# Altium schematic sheet Callisto Control Board.SchDoc
size A3; SheetNumber: 1; SheetTotal: 12
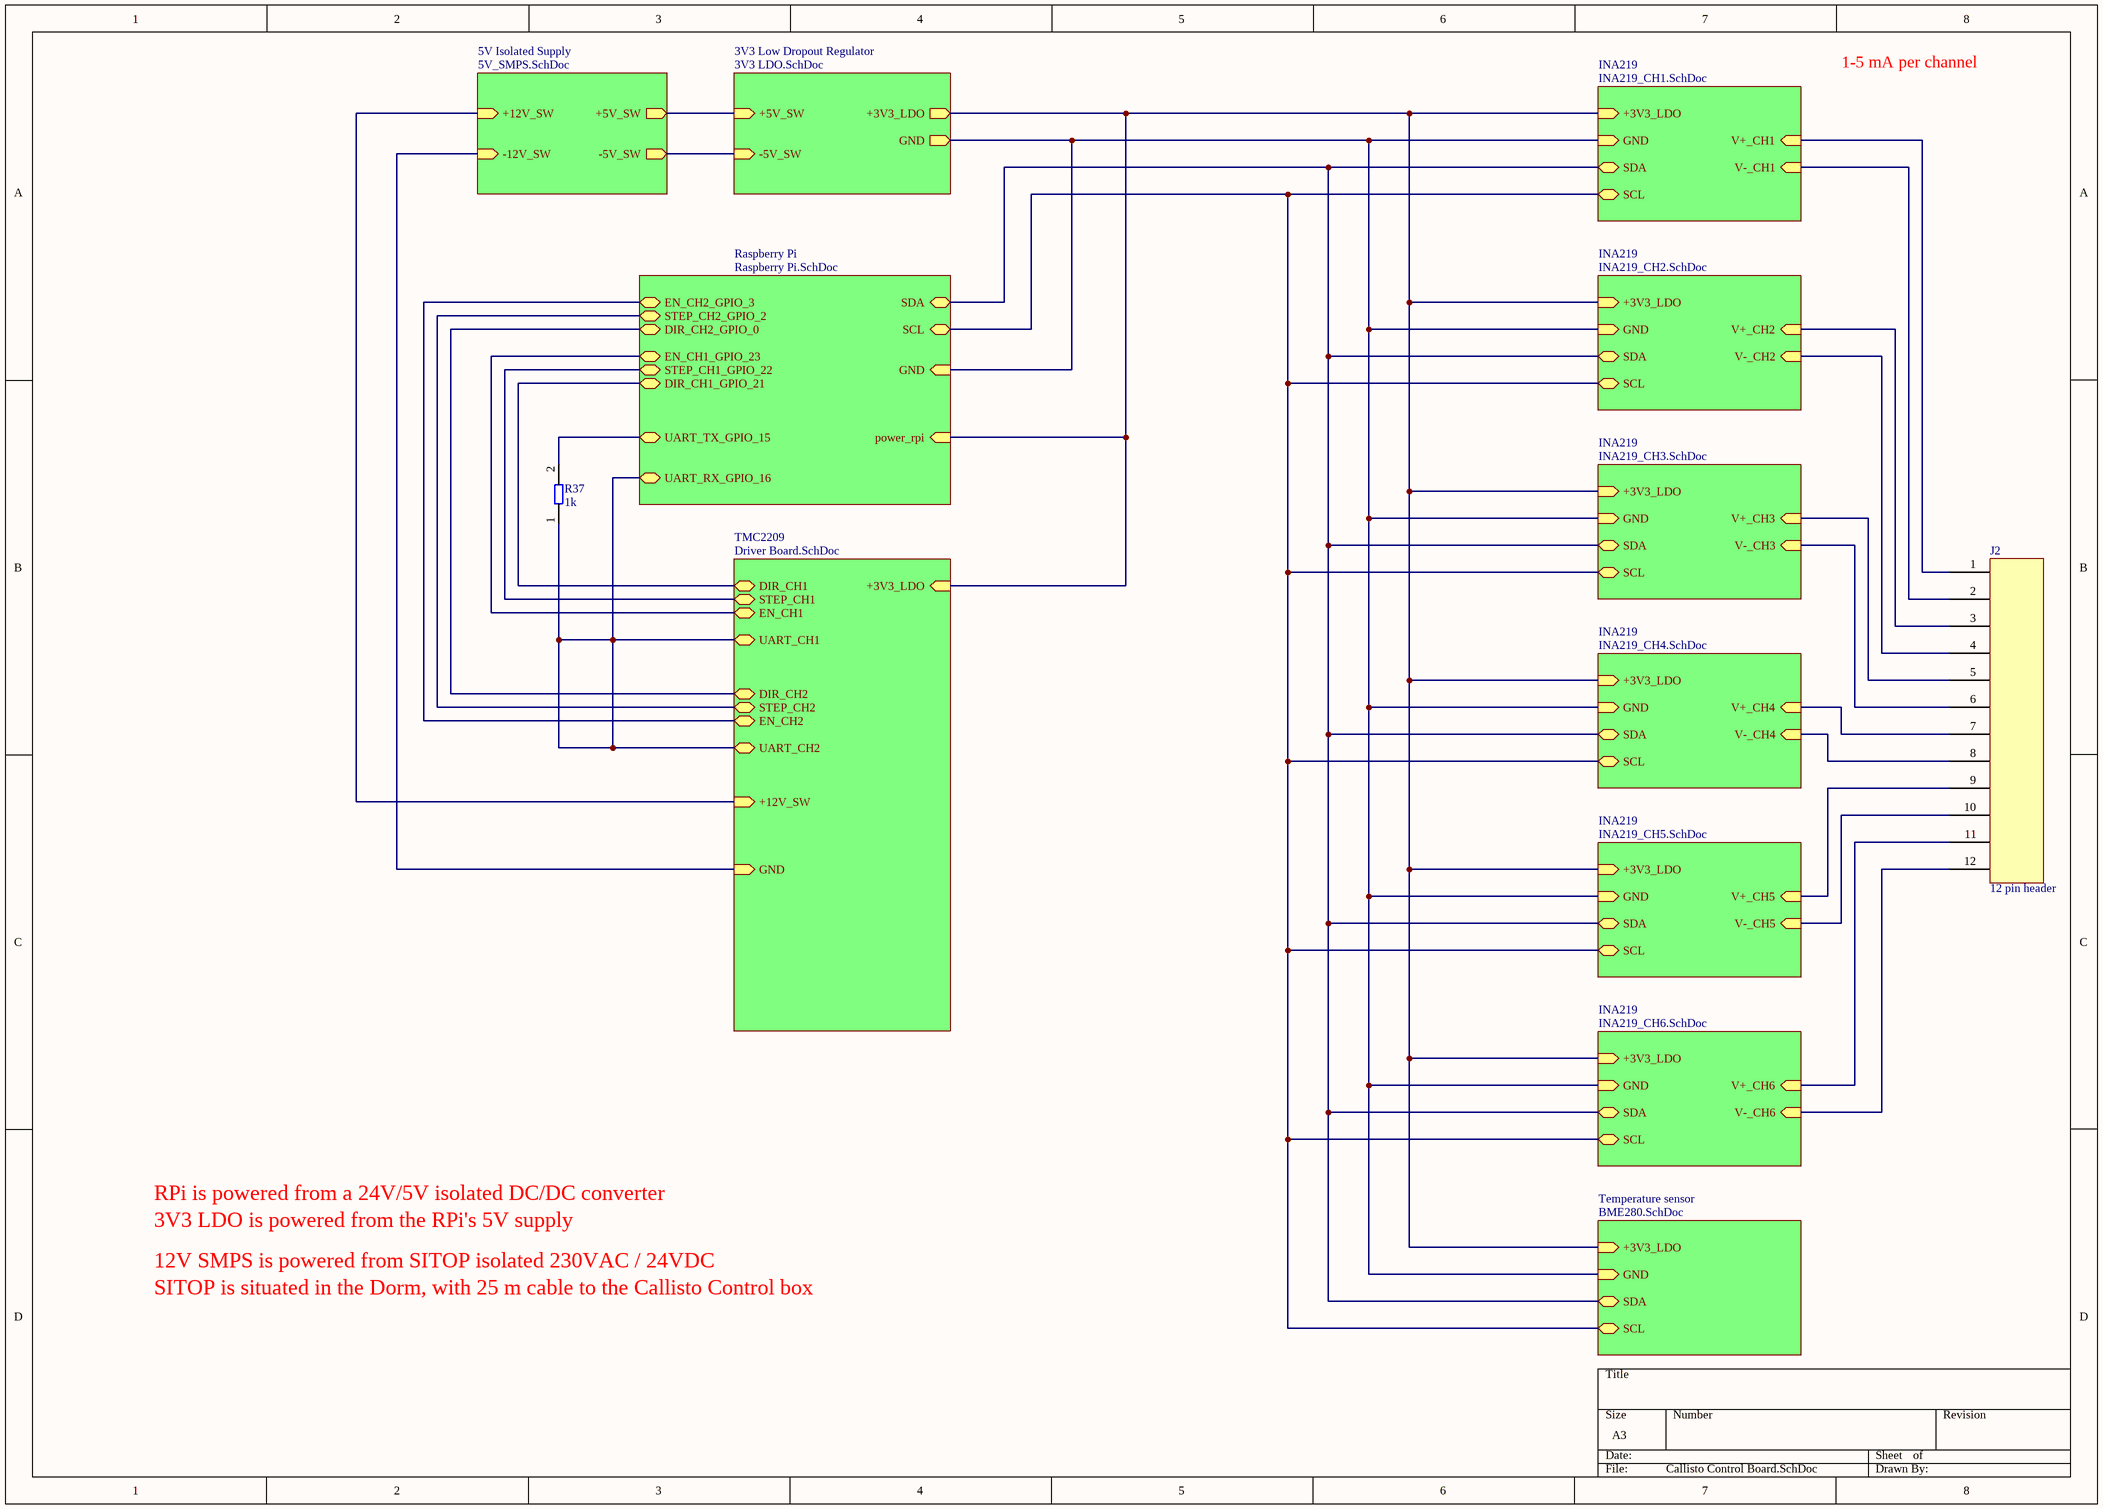
[diagram p0: Callisto Control Board.SchDoc]

## Parts
J2  12 pin header  [12 pin terminal]
R37  1k  [0805 Resistor - IPC A]

## Sub-sheets
3V3 Low Dropout Regulator = 3V3 LDO.SchDoc: +3V3_LDO (out), GND (out), +5V_SW (in), -5V_SW (in)
5V Isolated Supply = 5V_SMPS.SchDoc: +12V_SW (in), -12V_SW (in), +5V_SW (out), -5V_SW (out)
INA219 = INA219_CH1.SchDoc: SDA (bidir), SCL (bidir), +3V3_LDO (in), GND (in), V+_CH1 (in), V-_CH1 (in)
INA219 = INA219_CH2.SchDoc: SDA (bidir), SCL (bidir), +3V3_LDO (in), GND (in), V+_CH2 (in), V-_CH2 (in)
INA219 = INA219_CH3.SchDoc: SDA (bidir), SCL (bidir), +3V3_LDO (in), GND (in), V+_CH3 (in), V-_CH3 (in)
INA219 = INA219_CH4.SchDoc: SDA (bidir), SCL (bidir), +3V3_LDO (in), GND (in), V+_CH4 (in), V-_CH4 (in)
INA219 = INA219_CH5.SchDoc: SDA (bidir), SCL (bidir), +3V3_LDO (in), GND (in), V+_CH5 (in), V-_CH5 (in)
INA219 = INA219_CH6.SchDoc: SDA (bidir), SCL (bidir), +3V3_LDO (in), GND (in), V+_CH6 (in), V-_CH6 (in)
Raspberry Pi = Raspberry Pi.SchDoc: SDA (bidir), SCL (bidir), GND (in), UART_TX_GPIO_15 (bidir), UART_RX_GPIO_16 (bidir), STEP_CH2_GPIO_2 (bidir), EN_CH2_GPIO_3 (bidir), DIR_CH1_GPIO_21 (bidir), STEP_CH1_GPIO_22 (bidir), EN_CH1_GPIO_23 (bidir), DIR_CH2_GPIO_0 (bidir), power_rpi (in)
Temperature sensor = BME280.SchDoc: GND (in), +3V3_LDO (in), SCL (bidir), SDA (bidir)
TMC2209 = Driver Board.SchDoc: +3V3_LDO (in), DIR_CH2 (bidir), STEP_CH2 (bidir), EN_CH2 (bidir), DIR_CH1 (bidir), STEP_CH1 (bidir), EN_CH1 (bidir), +12V_SW (in), GND (in), UART_CH2 (bidir), UART_CH1 (bidir)

## Nets
NetJ2_1: J2.1 ; sheet INA219/V+_CH1
NetJ2_2: J2.2 ; sheet INA219/V-_CH1
NetJ2_3: J2.3 ; sheet INA219/V+_CH2
NetJ2_4: J2.4 ; sheet INA219/V-_CH2
NetJ2_5: J2.5 ; sheet INA219/V+_CH3
NetJ2_6: J2.6 ; sheet INA219/V-_CH3
NetJ2_7: J2.7 ; sheet INA219/V+_CH4
NetJ2_8: J2.8 ; sheet INA219/V-_CH4
NetJ2_9: J2.9 ; sheet INA219/V+_CH5
NetJ2_10: J2.10 ; sheet INA219/V-_CH5
NetJ2_11: J2.11 ; sheet INA219/V+_CH6
NetJ2_12: J2.12 ; sheet INA219/V-_CH6
NetR37_1: R37.1 ; sheet Raspberry Pi/UART_RX_GPIO_16, sheet TMC2209/UART_CH2, sheet TMC2209/UART_CH1
NetR37_2: R37.2 ; sheet Raspberry Pi/UART_TX_GPIO_15
(unnamed): sheet INA219/SDA, sheet INA219/SDA, sheet INA219/SDA, sheet INA219/SDA, sheet INA219/SDA, sheet INA219/SDA, sheet Raspberry Pi/SDA, sheet Temperature sensor/SDA
(unnamed): sheet INA219/SCL, sheet INA219/SCL, sheet INA219/SCL, sheet INA219/SCL, sheet INA219/SCL, sheet INA219/SCL, sheet Raspberry Pi/SCL, sheet Temperature sensor/SCL
(unnamed): sheet INA219/+3V3_LDO, sheet 3V3 Low Dropout Regulator/+3V3_LDO, sheet INA219/+3V3_LDO, sheet INA219/+3V3_LDO, sheet INA219/+3V3_LDO, sheet INA219/+3V3_LDO, sheet INA219/+3V3_LDO, sheet Raspberry Pi/power_rpi, sheet Temperature sensor/+3V3_LDO, sheet TMC2209/+3V3_LDO
(unnamed): sheet INA219/GND, sheet 3V3 Low Dropout Regulator/GND, sheet INA219/GND, sheet INA219/GND, sheet INA219/GND, sheet INA219/GND, sheet INA219/GND, sheet Raspberry Pi/GND, sheet Temperature sensor/GND
(unnamed): sheet 3V3 Low Dropout Regulator/+5V_SW, sheet 5V Isolated Supply/+5V_SW
(unnamed): sheet 3V3 Low Dropout Regulator/-5V_SW, sheet 5V Isolated Supply/-5V_SW
(unnamed): sheet Raspberry Pi/STEP_CH2_GPIO_2, sheet TMC2209/STEP_CH2
(unnamed): sheet Raspberry Pi/EN_CH2_GPIO_3, sheet TMC2209/EN_CH2
(unnamed): sheet Raspberry Pi/DIR_CH1_GPIO_21, sheet TMC2209/DIR_CH1
(unnamed): sheet Raspberry Pi/STEP_CH1_GPIO_22, sheet TMC2209/STEP_CH1
(unnamed): sheet Raspberry Pi/EN_CH1_GPIO_23, sheet TMC2209/EN_CH1
(unnamed): sheet Raspberry Pi/DIR_CH2_GPIO_0, sheet TMC2209/DIR_CH2
(unnamed): sheet TMC2209/+12V_SW, sheet 5V Isolated Supply/+12V_SW
(unnamed): sheet TMC2209/GND, sheet 5V Isolated Supply/-12V_SW

## Notes on the sheet
- 1-5 mA per channel
- RPi is powered from a 24V/5V isolated DC/DC converter
- 3V3 LDO is powered from the RPi's 5V supply
- 12V SMPS is powered from SITOP isolated 230VAC / 24VDC
- SITOP is situated in the Dorm, with 25 m cable to the Callisto Control box

## Library data of the parts
J2 = 12 pin terminal
R37 = RC0805FR-071KL: Thick Film Resistors - SMD 1 kOhms 125 mW 0805 1% / RC0805FR-071KL; Value: 1k; Part Number: RC0805FR-071KL